# Altium project LS1-LS2.PrjPCB
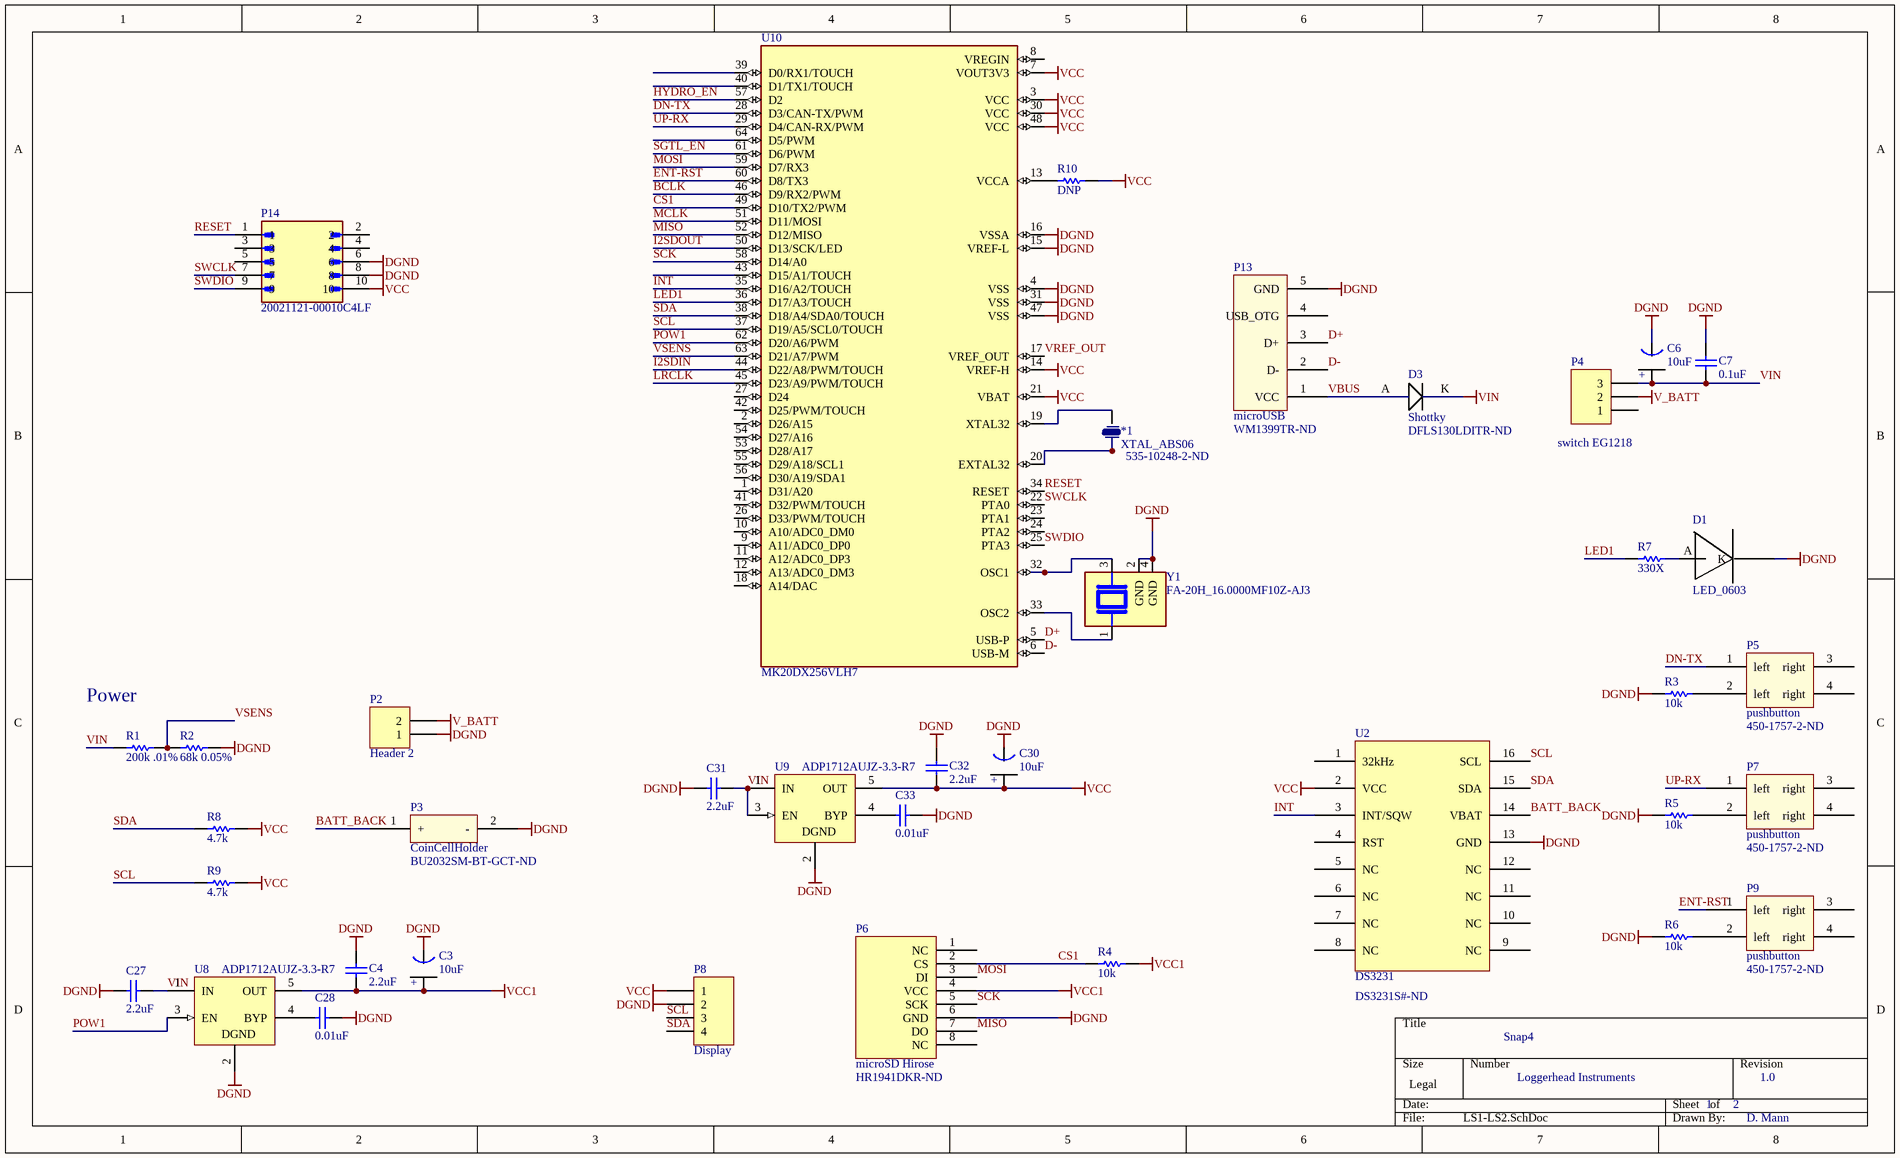
[diagram p0: LS1-LS2.SchDoc]
2 sheets, 66 parts. Net scope: global (net labels, ports and power ports of the same name join across sheets).
Board file: LS1-LS2.PcbDoc
Sheets:
  LS1-LS2.SchDoc
  LS1-LS2_audio.SchDoc

## Sheet LS1-LS2.SchDoc
size Legal

### Parts
*1  XTAL_ABS06  Supplier Part Number 1: 535-10248-2-ND  [XTAL-ABS06]
C3  10uF  [Tant0805]
C4  2.2uF  [0402]
C6  10uF  [Tant0805]
C7  0.1uF  [0402]
C27  2.2uF  [0402]
C28  0.01uF  [0402]
C30  10uF  [Tant0805]
C31  2.2uF  [0402]
C32  2.2uF  [0402]
C33  0.01uF  [0402]
D1  LED_0603  [Diode0603]
D3  Shottky  Supplier Part Number 1: DFLS130LDITR-ND  [DFLS130]
P2  Header 2  [HDR1X2]
P3  CoinCellHolder  Supplier Part Number 1: BU2032SM-BT-GCT-ND  [CoinCellHolder]
P4  switch EG1218  [HDR1X3]
P5  pushbutton  Supplier Part Number 1: 450-1757-2-ND  [SOP4]
P6  microSD Hirose  Supplier Part Number 1: HR1941DKR-ND  [DM3D microSD]
P7  pushbutton  Supplier Part Number 1: 450-1757-2-ND  [SOP4]
P8  Display  [HDR1X4]
P9  pushbutton  Supplier Part Number 1: 450-1757-2-ND  [SOP4]
P13  microUSB  Supplier Part Number 1: WM1399TR-ND  [microUSB-B]
P14  20021121-00010C4LF  [AMPHENOL_20021121-00010C4LF]
R1  200k .01%  [3-0603]
R2  68k 0.05%  [3-0603]
R3  10k  [3-0603]
R4  10k  [3-0603]
R5  10k  [3-0603]
R6  10k  [3-0603]
R7  330X  [3-0603]
R8  4.7k  [3-0603]
R9  4.7k  [3-0603]
R10  DNP  [3-0603]
U2  DS3231  Supplier Part Number 1: DS3231S#-ND  [DS3231]
U8  ADP1712AUJZ-3.3-R7  [MF05A_N]
U9  ADP1712AUJZ-3.3-R7  [MF05A_N]
U10  MK20DX256VLH7  [QFP50P1200X1200X160-64N]
Y1  FA-20H_16.0000MF10Z-AJ3  [XTAL_FA-20H_16.0000MF10Z-AJ3]

### Nets
DGND: C3.1(GND) C4.2 C6.1(GND) C7.2 C27.2 C28.2 C30.1(GND) C31.2 C32.2 C33.2 D1.K P2.1 P3.2(-) P6.6(GND) P8.2 P13.5(GND) P14.6 P14.8 R2.1 R3.2 R5.2 R6.2 U2.13(GND) U8.2(GND) U9.2(GND) U10.4(VSS) U10.15(VREF-L) U10.16(VSSA) U10.31(VSS) U10.47(VSS) Y1.2(GND) Y1.4(GND)
V_BATT: P2.2 P4.2
VCC: C30.2(+) C32.1 P8.1 P14.10 R8.2 R9.2 R10.2 U2.2(VCC) U9.5(OUT) U10.3(VCC) U10.7(VOUT3V3) U10.14(VREF-H) U10.21(VBAT) U10.30(VCC) U10.48(VCC)
VCC1: C3.2(+) C4.1 P6.4(VCC) R4.1 U8.5(OUT)
VIN: C6.2(+) C7.1 C27.1 C31.1 D3.K P4.3 R1.2 U8.1(IN) U9.1(IN) U9.3(EN)
BATT_BACK: P3.1(+) U2.14(VBAT)
BCLK: U10.46(D9/RX2/PWM)
CS1: P6.2(CS) R4.2 U10.49(D10/TX2/PWM)
D+: P13.3(D+) U10.5(USB-P)
D-: P13.2(D-) U10.6(USB-M)
DN-TX: P5.1(left) U10.28(D3/CAN-TX/PWM)
ENT-RST: P9.1(left) U10.60(D8/TX3)
HYDRO_EN: U10.57(D2)
I2SDIN: U10.44(D22/A8/PWM/TOUCH)
I2SDOUT: U10.50(D13/SCK/LED)
INT: U2.3(INT/SQW) U10.35(D16/A2/TOUCH)
LED1: R7.1 U10.36(D17/A3/TOUCH)
LRCLK: U10.45(D23/A9/PWM/TOUCH)
MCLK: U10.51(D11/MOSI)
MISO: P6.7(DO) U10.52(D12/MISO)
MOSI: P6.3(DI) U10.59(D7/RX3)
POW1: U8.3(EN) U10.62(D20/A6/PWM)
RESET: P14.1 U10.34(RESET)
SCK: P6.5(SCK) U10.58(D14/A0)
SCL: P8.3 R9.1 U2.16(SCL) U10.37(D19/A5/SCL0/TOUCH)
SDA: P8.4 R8.1 U2.15(SDA) U10.38(D18/A4/SDA0/TOUCH)
SGTL_EN: U10.61(D6/PWM)
SWCLK: P14.7 U10.22(PTA0)
SWDIO: P14.9 U10.25(PTA3)
UP-RX: P7.1(left) U10.29(D4/CAN-RX/PWM)
VBUS: D3.A P13.1(VCC)
VREF_OUT: U10.17(VREF_OUT)
VSENS: R1.1 R2.2 U10.63(D21/A7/PWM)
Net*1_1: *1.1 U10.20(EXTAL32)
Net*1_2: *1.2 U10.19(XTAL32)
NetC28_1: C28.1 U8.4(BYP)
NetC33_1: C33.1 U9.4(BYP)
NetD1_A: D1.A R7.2
NetP5_2: P5.2(left) R3.1
NetP7_2: P7.2(left) R5.1
NetP9_2: P9.2(left) R6.1
NetR10_1: R10.1 U10.13(VCCA)
NetU10_32: U10.32(OSC1) Y1.3
NetU10_33: U10.33(OSC2) Y1.1

Not connected (* = marked no-connect by the designer): P4 1; P5 3(right) 4(right); P6 1(NC) 8(NC); P7 3(right) 4(right); P9 3(right) 4(right); P13 4(USB_OTG); P14 2 3 4 5; U2 1(32kHz) 4(RST) 5(NC) 6(NC) 7(NC) 8(NC) 9(NC) 10(NC) 11(NC) 12(NC); U10 1(D31/A20) 2(D26/A15) 8(VREGIN) 9(A11/ADC0_DP0) 10(A10/ADC0_DM0) 11(A12/ADC0_DP3) 12(A13/ADC0_DM3) 18(A14/DAC) 23(PTA1) 24(PTA2) 26(D33/PWM/TOUCH) 27(D24) 39(D0/RX1/TOUCH) 40(D1/TX1/TOUCH) 41(D32/PWM/TOUCH) 42(D25/PWM/TOUCH) 43(D15/A1/TOUCH) 53(D28/A17) 54(D27/A16) 55(D29/A18/SCL1) 56(D30/A19/SDA1) 64(D5/PWM)

### Notes on the sheet
- Power
- Snap4
- Loggerhead Instruments
- 1
- 2
- 1.0
- D. Mann
- (in symbol LP3985IM5-3.3) DGND

### Library data of the parts
C3 C6 C30 = Tant0805: Value: 10uF
C4 C27 C28 C31-C33 = C0402: Ceramic Chip Capacitor - Standard; Note: Footprint corresponds to dimensions for bulk cassette packaging. This case size has tightened tolerances.; Value: 0.1uF; Published: 17-Jul-2002; LatestRevisionDate: 19-Mar-2004; LatestRevisionNote: Silkscreen size reduced.; DatasheetDocument: Mar-2001; PackageDocument: Mar-2001; PackageReference: 0402; Publisher: Altium Limited; Code_JEITA: 0402; Code_IPC: 1005 [0402]; ComponentLink1Description: Manufacturer Link; ComponentLink1URL: http://www.kemet.com/; ComponentLink2Description: Datasheet; ComponentLink2URL: http://www.kemet.com/kemet/web/homepage/kechome.nsf/vapubfilesname/F3102TA.pdf/$file/F3102TA.pdf
C7 = C0402: Ceramic Chip Capacitor - Standard; Note: Footprint corresponds to dimensions for bulk cassette packaging. This case size has tightened tolerances.; Published: 17-Jul-2002; LatestRevisionDate: 19-Mar-2004; LatestRevisionNote: Silkscreen size reduced.; DatasheetDocument: Mar-2001; PackageDocument: Mar-2001; PackageReference: 0402; Publisher: Altium Limited; Code_JEITA: 0402; Code_IPC: 1005 [0402]; ComponentLink1Description: Manufacturer Link; ComponentLink1URL: http://www.kemet.com/; ComponentLink2Description: Datasheet; ComponentLink2URL: http://www.kemet.com/kemet/web/homepage/kechome.nsf/vapubfilesname/F3102TA.pdf/$file/F3102TA.pdf; Value: 0.1uF
D3 = DFLS130: Supplier 1: Digi-Key
P2 = Header 2: Header, 2-Pin; LatestRevisionDate: 17-Jul-2002; LatestRevisionNote: Re-released for DXP Platform.; Publisher: Altium Limited
P4 = Header 3: Header, 3-Pin; LatestRevisionDate: 17-Jul-2002; LatestRevisionNote: Re-released for DXP Platform.; Publisher: Altium Limited
P8 = Header 4: Header, 4-Pin; LatestRevisionDate: 17-Jul-2002; LatestRevisionNote: Re-released for DXP Platform.; Publisher: Altium Limited
P13 = microUSB-B: Supplier 1: Digi-Key
P14 = 20021121-00010C4LF: Conn Rect BrdtoBrd UnshroudedHeader 10Cnts SMT 1.27x1.27mmSpng | Amphenol FCI (Amphenol CS) 20021121-00010C4LF; MF: Amphenol ICC; SnapEDA_Link: https://www.snapeda.com/parts/20021121-00010C4LF/Amphenol+FCI/view-part/?ref=snap; Package: None; Value: *; MP: 20021121-00010C4LF; Check_prices: https://www.snapeda.com/parts/20021121-00010C4LF/Amphenol+FCI/view-part/?ref=eda
R1-R10 = ERJ3RK: Precision Thick Film Chip Resistor, 10 Ohm to 1M Ohm Range, 1% and 0.5% Tolerance, 0603 Size, 0.063 W; Published: 17-Dec-2003; LatestRevisionDate: 19-Mar-2004; LatestRevisionNote: Silkscreen size reduced.; PackageDocument: Mar-2003; PackageReference: 3-0603; Publisher: Altium Limited; Code_IPC: 1608 [0603]; ComponentLink1Description: Manufacturer Link; ComponentLink1URL: http://www.panasonic.com/industrial/components/resistive_products.htm; ComponentLink2Description: Datasheet; ComponentLink2URL: http://www.panasonic.com/industrial/components/pdf/AOA0000CE2.pdf
U8 U9 = LP3985IM5-3.3: Micropower, 150mA Low-Noise Ultra Low-Dropout CMOS Voltage Regulator; Manufacturer: National Semiconductor; CompType: LDO IC; PackageTopMarking: LDQB*XTT; PowerWise: N; Published: 4-Dec-2008; DatasheetVersion: Aug-2005; PackageVersion: revD, Aug-2008; PackageReference: MF05A; Publisher: Altium Limited; PackageDescription: Molded SOT-23, .115 x .063 x .040 in Body, 5 Lead, .0375 in Pitch; PartNumber: LP3985IM5-3.3; RoHS: O; PinCount: 5; DigiKeyPartNumber: LP3985IM5-3.3CT-ND; ComponentLink1Description: LP3985 Datasheet; ComponentLink1URL: http://www.national.com/ds/LP/LP3985.pdf; ComponentLink2Description: LP3985 Web Page; ComponentLink2URL: http://www.national.com/pf/LP/LP3985.html; ComponentLink3Description: MF05A Package Page; ComponentLink3URL: http://www.national.com/packaging/folders/mf05a.html
U10 = MK20DX256VLH7: ARMÂ®CortexÂ®-M4Kinetis K20å¾®æŽ§åˆ¶å™¨IC 32ä½72MHz 256KBï¼ˆ256K x 8ï¼‰FLASH 64-LQFPï¼ˆ10x10ï¼‰; MF: NXP USA; Package: LQFP-64 NXP Semiconductors; Availability: Unavailable; SnapEDA_Link: https://www.snapeda.com/parts/MK20DX256VLH7/NXP%20USA%20Inc./view-part/625714/?ref=snap; MP: MK20DX256VLH7; Price: None; Value: *
Y1 = FA-20H_16.0000MF10Z-AJ3: 16 MHz ±10ppm Crystal 8pF 80 Ohms 4-SMD, No Lead; MF: EPSON; MP: FA-20H 16.0000MF10Z-AJ3; SnapEDA_Link: https://www.snapeda.com/parts/FA-20H%2016.0000MF10Z-AJ3/EPSON/view-part/?ref=snap; Package: NON STANDARD-4 EPSON; Value: *; Check_prices: https://www.snapeda.com/parts/FA-20H%2016.0000MF10Z-AJ3/EPSON/view-part/?ref=eda
*1 = XTAL_ABS06: Supplier 1: Digi-Key
P3 = CoinCellHolder: Supplier 1: Digi-Key
P5 P7 P9 = pushbutton: Supplier 1: Digi-Key
P6 = microSD Hirose: Supplier 1: Digi-Key
U2 = DS3231: Supplier 1: Digi-Key

## Sheet LS1-LS2_audio.SchDoc
size A
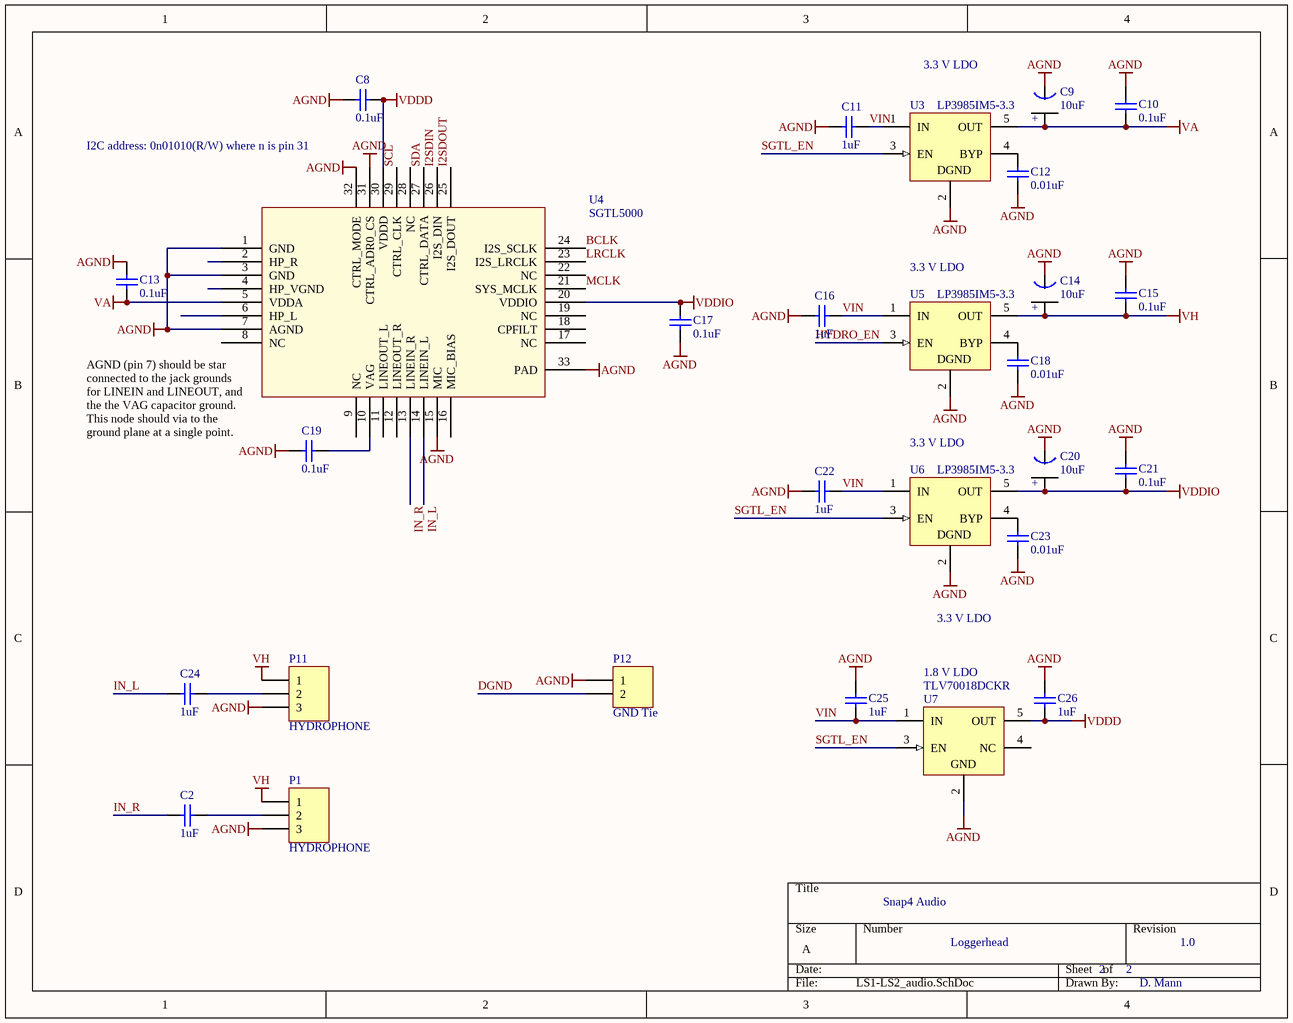
[diagram p1: LS1-LS2_audio.SchDoc]

### Parts
C2  1uF  [0402]
C8  0.1uF  [0402]
C9  10uF  [Tant0805]
C10  0.1uF  [0402]
C11  1uF  [0402]
C12  0.01uF  [0402]
C13  0.1uF  [0402]
C14  10uF  [Tant0805]
C15  0.1uF  [0402]
C16  1uF  [0402]
C17  0.1uF  [0402]
C18  0.01uF  [0402]
C19  0.1uF  [0402]
C20  10uF  [Tant0805]
C21  0.1uF  [0402]
C22  1uF  [0402]
C23  0.01uF  [0402]
C24  1uF  [0402]
C25  1uF  [0402]
C26  1uF  [0402]
P1  HYDROPHONE  [HDR1X3]
P11  HYDROPHONE  [HDR1X3]
P12  GND Tie  [HDR1X2]
U3  LP3985IM5-3.3  [MF05A_N]
U4  SGTL5000  [QFN32]
U5  LP3985IM5-3.3  [MF05A_N]
U6  LP3985IM5-3.3  [MF05A_N]
U7  TLV70018DCKR  [TI-DCK5_V]

### Nets
AGND: C8.2 C9.1(GND) C10.2 C11.2 C12.2 C13.2 C14.1(GND) C15.2 C16.2 C17.2 C18.2 C19.2 C20.1(GND) C21.2 C22.2 C23.2 C25.2 C26.2 P1.3 P11.3 P12.1 U3.2(GND) U4.1(GND) U4.3(GND) U4.7(AGND) U4.15(MIC) U4.31(CTRL_ADR0_CS) U4.32(CTRL_MODE) U4.33(PAD) U5.2(GND) U6.2(GND) U7.2(GND)
DGND: P12.2
VA: C9.2(+) C10.1 C13.1 U3.5(OUT) U4.5(VDDA)
VDDD: C8.1 C26.1 U4.30(VDDD) U7.5(OUT)
VDDIO: C17.1 C20.2(+) C21.1 U4.20(VDDIO) U6.5(OUT)
VH: C14.2(+) C15.1 P1.1 P11.1 U5.5(OUT)
VIN: C11.1 C16.1 C22.1 C25.1 U3.1(IN) U5.1(IN) U6.1(IN) U7.1(IN)
BCLK: U4.24(I2S_SCLK)
HYDRO_EN: U5.3(EN)
I2SDIN: U4.26(I2S_DIN)
I2SDOUT: U4.25(I2S_DOUT)
IN_L: C24.2 U4.14(LINEIN_L)
IN_R: C2.2 U4.13(LINEIN_R)
LRCLK: U4.23(I2S_LRCLK)
MCLK: U4.21(SYS_MCLK)
SCL: U4.29(CTRL_CLK)
SDA: U4.27(CTRL_DATA)
SGTL_EN: U3.3(EN) U6.3(EN) U7.3(EN)
NetC2_1: C2.1 P1.2
NetC12_1: C12.1 U3.4(BYP)
NetC18_1: C18.1 U5.4(BYP)
NetC19_1: C19.1 U4.10(VAG)
NetC23_1: C23.1 U6.4(BYP)
NetC24_1: C24.1 P11.2

Not connected (* = marked no-connect by the designer): U4 2(HP_R) 4(HP_VGND) 6(HP_L) 8(NC) 9(NC) 11(LINEOUT_L) 12(LINEOUT_R) 16(MIC_BIAS) 17(NC) 18(CPFILT) 19(NC) 22(NC) 28(NC); U7 4(NC)

### Notes on the sheet
- 3.3 V LDO
- I2C address: 0n01010(R/W) where n is pin 31
- (near U5) 3.3 V LDO
- (near U4) AGND (pin 7) should be star connected to the jack grounds for LINEIN and LINEOUT, and the the VAG capacitor ground. This node should via to the ground plane at a single point.
- (near U6) 3.3 V LDO
- (near U7) 1.8 V LDO
- Snap4 Audio
- Loggerhead
- 2
- 1.0
- D. Mann
- (in symbol LP3985IM5-3.3) DGND

### Library data of the parts
C2 C11 C12 C16 C18 C22-C26 = C0402: as C4 on sheet LS1-LS2; Published: 17-Jul-2002; LatestRevisionDate: 19-Mar-2004; LatestRevisionNote: Silkscreen size reduced.; DatasheetDocument: Mar-2001; PackageDocument: Mar-2001; PackageReference: 0402; Publisher: Altium Limited; Code_JEITA: 0402; Code_IPC: 1005 [0402]; ComponentLink1Description: Manufacturer Link; ComponentLink1URL: http://www.kemet.com/; ComponentLink2Description: Datasheet; ComponentLink2URL: http://www.kemet.com/kemet/web/homepage/kechome.nsf/vapubfilesname/F3102TA.pdf/$file/F3102TA.pdf
C8 C10 C13 C15 C17 C19 C21 = C0402: as C7 on sheet LS1-LS2; Published: 17-Jul-2002; LatestRevisionDate: 19-Mar-2004; LatestRevisionNote: Silkscreen size reduced.; DatasheetDocument: Mar-2001; PackageDocument: Mar-2001; PackageReference: 0402; Publisher: Altium Limited; Code_JEITA: 0402; Code_IPC: 1005 [0402]; ComponentLink1Description: Manufacturer Link; ComponentLink1URL: http://www.kemet.com/; ComponentLink2Description: Datasheet; ComponentLink2URL: http://www.kemet.com/kemet/web/homepage/kechome.nsf/vapubfilesname/F3102TA.pdf/$file/F3102TA.pdf; Value: 0.1uF
C9 C14 C20 = Tant0805: Value: 10uF
P1 P11 = Header 3: Header, 3-Pin; LatestRevisionDate: 17-Jul-2002; LatestRevisionNote: Re-released for DXP Platform.; Publisher: Altium Limited
P12 = Header 2: Header, 2-Pin; LatestRevisionDate: 17-Jul-2002; LatestRevisionNote: Re-released for DXP Platform.; Publisher: Altium Limited
U3 U5 U6 = LP3985IM5-3.3: as U8 on sheet LS1-LS2; Published: 4-Dec-2008; DatasheetVersion: Aug-2005; PackageVersion: revD, Aug-2008; PackageReference: MF05A; Publisher: Altium Limited; PackageDescription: Molded SOT-23, .115 x .063 x .040 in Body, 5 Lead, .0375 in Pitch; PartNumber: LP3985IM5-3.3; RoHS: O; PinCount: 5; DigiKeyPartNumber: LP3985IM5-3.3CT-ND; ComponentLink1Description: LP3985 Datasheet; ComponentLink1URL: http://www.national.com/ds/LP/LP3985.pdf; ComponentLink2Description: LP3985 Web Page; ComponentLink2URL: http://www.national.com/pf/LP/LP3985.html; ComponentLink3Description: MF05A Package Page; ComponentLink3URL: http://www.national.com/packaging/folders/mf05a.html
U7 = TLV70018DCKR: Single Output LDO, 200 mA, Fixed 1.8 V Output, 2 to 5.5 V Input, with Low IQ, 5-pin SC70 (DCK), -40 to 125 degC, Green (RoHS & no Sb/Br); Manufacturer: Texas Instruments; Accuracy(%): 2; Fixed Output Options(V): 1.8; Iout(Max)(A): 0.2; Iq(Typ)(mA): 0.03; SubFamily: Single Channel LDO; Vdo(Typ)(mV): 175; Vin(Max)(V): 5.5; DatasheetVersion: SLVSA00D; PackageVersion: 4093553-3/G; PackageReference: DCK5; PackageDescription: 5-Pin Plastic Small-Outline, Body 2 x 1.25 mm, Pitch 0.65 mm; Supplier 1: Digi-Key; Supplier Part Number 1: 296-32409-2-ND; Supplier 2: Digi-Key; Supplier Part Number 2: 296-32409-1-ND; Supplier 3: Digi-Key; Supplier Part Number 3: 296-32409-6-ND; Supplier 4: Newark; Supplier Part Number 4: 55R7461; Supplier 5: Mouser; Supplier Part Number 5: 595-TLV70018DCKR; Eco-Plan: Green (RoHS & no Sb/Br); Vin(Min)(V): 2; Vout Adj(Max)(V): 1.8; Vout Adj(Min)(V): 1.8; Mounting Technology: Surface Mount; Code_JEDEC: MO-203; PartNumber: TLV70018DCKR; ComponentLink1Description: Manufacturer URL; ComponentLink1URL: http://www.ti.com/; ComponentLink2Description: Datasheet; ComponentLink2URL: http://www.ti.com/general/docs/lit/getliterature.tsp?genericPartNumber=TLV70018&fileType=pdf; ComponentLink3Description: Package Specification; ComponentLink3URL: http://www.ti.com/litv/pdf/mpds025f

## Nets that join several sheets
DGND: LS1-LS2 (32 pins), LS1-LS2_audio (P12.2)
VIN: LS1-LS2 (10 pins), LS1-LS2_audio (8 pins)
BCLK: LS1-LS2 (U10.46), LS1-LS2_audio (U4.24)
HYDRO_EN: LS1-LS2 (U10.57), LS1-LS2_audio (U5.3)
I2SDIN: LS1-LS2 (U10.44), LS1-LS2_audio (U4.26)
I2SDOUT: LS1-LS2 (U10.50), LS1-LS2_audio (U4.25)
LRCLK: LS1-LS2 (U10.45), LS1-LS2_audio (U4.23)
MCLK: LS1-LS2 (U10.51), LS1-LS2_audio (U4.21)
SCL: LS1-LS2 (P8.3 R9.1 U2.16 U10.37), LS1-LS2_audio (U4.29)
SDA: LS1-LS2 (P8.4 R8.1 U2.15 U10.38), LS1-LS2_audio (U4.27)
SGTL_EN: LS1-LS2 (U10.61), LS1-LS2_audio (U3.3 U6.3 U7.3)